# EAGLE design quick_mock (EAGLE 9.6.2)
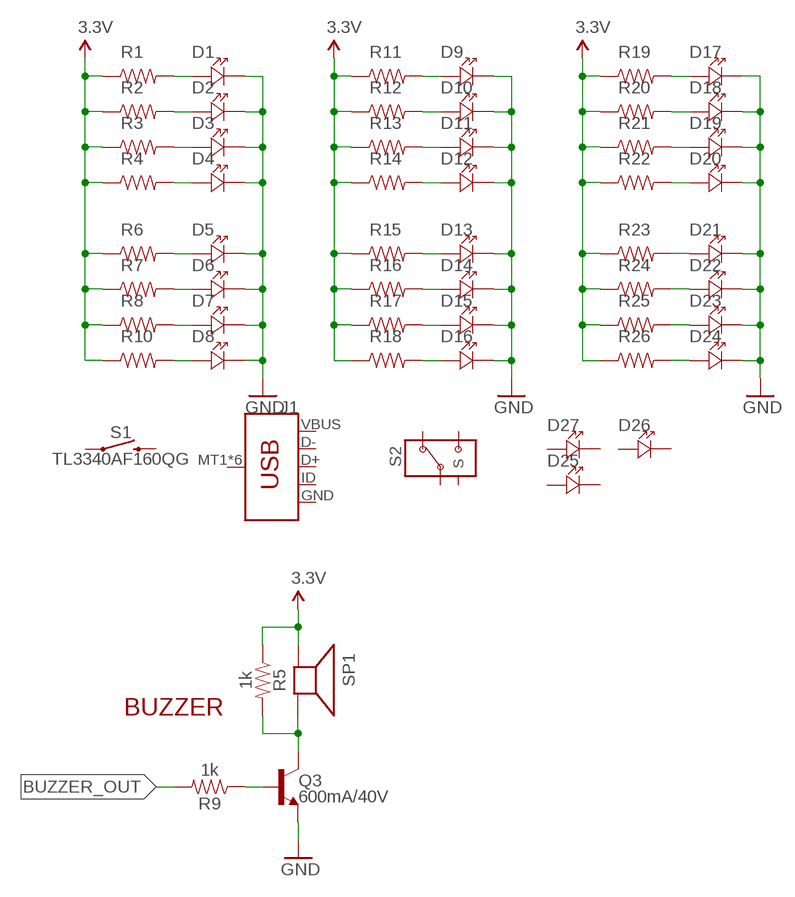
[diagram p0: schematic, sheet 1]

## Parts
D1  LED-603  [SMD-603]
D2  LED-603  [SMD-603]
D3  LED-603  [SMD-603]
D4  LED-603  [SMD-603]
D5  LED-603  [SMD-603]
D6  LED-603  [SMD-603]
D7  LED-603  [SMD-603]
D8  LED-603  [SMD-603]
D9  LED-603  [SMD-603]
D10  LED-603  [SMD-603]
D11  LED-603  [SMD-603]
D12  LED-603  [SMD-603]
D13  LED-603  [SMD-603]
D14  LED-603  [SMD-603]
D15  LED-603  [SMD-603]
D16  LED-603  [SMD-603]
D17  LED-603  [SMD-603]
D18  LED-603  [SMD-603]
D19  LED-603  [SMD-603]
D20  LED-603  [SMD-603]
D21  LED-603  [SMD-603]
D22  LED-603  [SMD-603]
D23  LED-603  [SMD-603]
D24  LED-603  [SMD-603]
D25  VSMB2020X01  [GULL-WING-2.3MM]
D26  LED-603  [SMD-603]
D27  VSMB2020X01  [GULL-WING-2.3MM]
J1  USB_MICRO-B  [USB-MICROB-10118192]
Q3  600mA/40V  TRANS_NPN-MMBT2222AL  [SOT23-3]
R1  RESISTOR-603  [SMD-603]
R2  RESISTOR-603  [SMD-603]
R3  RESISTOR-603  [SMD-603]
R4  RESISTOR-603  [SMD-603]
R5  1k  10KOHM-0603-1/10W-1%  [0603]
R6  RESISTOR-603  [SMD-603]
R7  RESISTOR-603  [SMD-603]
R8  RESISTOR-603  [SMD-603]
R9  1k  10KOHM-0603-1/10W-1%  [0603]
R10  RESISTOR-603  [SMD-603]
R11  RESISTOR-603  [SMD-603]
R12  RESISTOR-603  [SMD-603]
R13  RESISTOR-603  [SMD-603]
R14  RESISTOR-603  [SMD-603]
R15  RESISTOR-603  [SMD-603]
R16  RESISTOR-603  [SMD-603]
R17  RESISTOR-603  [SMD-603]
R18  RESISTOR-603  [SMD-603]
R19  RESISTOR-603  [SMD-603]
R20  RESISTOR-603  [SMD-603]
R21  RESISTOR-603  [SMD-603]
R22  RESISTOR-603  [SMD-603]
R23  RESISTOR-603  [SMD-603]
R24  RESISTOR-603  [SMD-603]
R25  RESISTOR-603  [SMD-603]
R26  RESISTOR-603  [SMD-603]
S1  TL3340AF160QG  [3PIN_GULLWING_4.0X3.3MM]
S2  CUS-12B  [CUS-12_SPDT]
SP1  SPEAKER/PS12  [PS12]

## Nets
3.3V: R1.1 R2.1 R3.1 R4.1 R5.1 R6.1 R7.1 R8.1 R10.1 R11.1 R12.1 R13.1 R14.1 R15.1 R16.1 R17.1 R18.1 R19.1 R20.1 R21.1 R22.1 R23.1 R24.1 R25.1 R26.1 SP1.P$1(+)
BUZZER_OUT: R9.2
GND: D1.P$2(CATHODE-) D2.P$2(CATHODE-) D3.P$2(CATHODE-) D4.P$2(CATHODE-) D5.P$2(CATHODE-) D6.P$2(CATHODE-) D7.P$2(CATHODE-) D8.P$2(CATHODE-) D9.P$2(CATHODE-) D10.P$2(CATHODE-) D11.P$2(CATHODE-) D12.P$2(CATHODE-) D13.P$2(CATHODE-) D14.P$2(CATHODE-) D15.P$2(CATHODE-) D16.P$2(CATHODE-) D17.P$2(CATHODE-) D18.P$2(CATHODE-) D19.P$2(CATHODE-) D20.P$2(CATHODE-) D21.P$2(CATHODE-) D22.P$2(CATHODE-) D23.P$2(CATHODE-) D24.P$2(CATHODE-) Q3.2(E)
N$1: D1.P$1(ANODE+) R1.2
N$2: D2.P$1(ANODE+) R2.2
N$3: Q3.3(C) R5.2 SP1.P$2(-)
N$4: D3.P$1(ANODE+) R3.2
N$5: D4.P$1(ANODE+) R4.2
N$6: D5.P$1(ANODE+) R6.2
N$7: D6.P$1(ANODE+) R7.2
N$8: D7.P$1(ANODE+) R8.2
N$9: D8.P$1(ANODE+) R10.2
N$14: D9.P$1(ANODE+) R11.2
N$15: D10.P$1(ANODE+) R12.2
N$16: D11.P$1(ANODE+) R13.2
N$17: D12.P$1(ANODE+) R14.2
N$18: D13.P$1(ANODE+) R15.2
N$19: D14.P$1(ANODE+) R16.2
N$20: D15.P$1(ANODE+) R17.2
N$21: D16.P$1(ANODE+) R18.2
N$22: D24.P$1(ANODE+) R26.2
N$23: D23.P$1(ANODE+) R25.2
N$24: D22.P$1(ANODE+) R24.2
N$25: D21.P$1(ANODE+) R23.2
N$26: Q3.1(B) R9.1
N$27: D20.P$1(ANODE+) R22.2
N$28: D19.P$1(ANODE+) R21.2
N$29: D18.P$1(ANODE+) R20.2
N$30: D17.P$1(ANODE+) R19.2
Unconnected: D25.P$1(ANODE+) D25.P$2(CATHODE-) D26.P$1(ANODE+) D26.P$2(CATHODE-) D27.P$1(ANODE+) D27.P$2(CATHODE-) J1.D+ J1.D- J1.ID J1.MT1(SHIELD) J1.MT2(SHIELD) J1.MT3(SHIELD) J1.MT4(SHIELD) J1.P$1(SHIELD) J1.P$2(SHIELD) S1.P$1 S1.P$2 S1.P$3 S2.P$1 S2.P$2 S2.P$3 S2.P$4(S) S2.P$5(S) S2.P$6(S) S2.P$7(S)

## Notes on the sheet
- BUZZER

## Power pins joined to a net without a drawn wire
GND: J1.GND
VBUS: J1.VBUS

## Library data of the parts
D1-D24 D26 = Rob-Diodes:LED
D25 D27 = Rob-Diodes:VSMB2020X01
J1 = SparkFun-Connectors-new:USB_MICRO-B: USB Type Micro-B Connector Male/female and PTH/SMT variants SparkFun Products: SparkFun microB USB Breakout <https://www.sparkfun.com/products/12035> SparkFun USB microB Plug Breakout <https://www.sparkfun.com/products/10031> SparkFun ESP8266 Thing <https://www.sparkfun.com/products/13231>
Q3 = SparkFun-DiscreteSemi:TRANS_NPN: NPN transistor Current controlled devices typically used to amplify current or used as a switch. BC547 - COM-08928 <http://www.sparkfun.com/products/8928> (TO-92 45V 100mA) (1.Collector 2.Base 3.Emitter) 2N3904 - COM-00521 <http://www.sparkfun.com/products/521> (TO-92 40V 200mA) (1.Emitter 2.Base 3.Collector) P2N2222A - COM-12852 <http://www.sparkfun.com/products/12852> (TO-92 40V 600mA) (1.Collector 2.Base 3.Emitter); PROD_ID: TRANS-08049
R1-R4 R6-R8 R10-R26 = Rob-Resistors:RESISTOR
R5 R9 = SparkFun-Resistors:10KOHM: 10kΩ resistor A resistor is a passive two-terminal electrical component that implements electrical resistance as a circuit element. Resistors act to reduce current flow, and, at the same time, act to lower voltage levels within circuits. - Wikipedia; PROD_ID: RES-00824; VALUE: 10k
S1 = Rob-Switches:TL3340AF160QG
S2 = IDEO-Switches:CUS-12B
SP1 = adafruit:SPEAKER: SPEAKER Source: Buerklin Added PS12 (for part # PS1240 piezo) http://www.ladyada.net/library/pcb/eaglelibrary.html

## Board
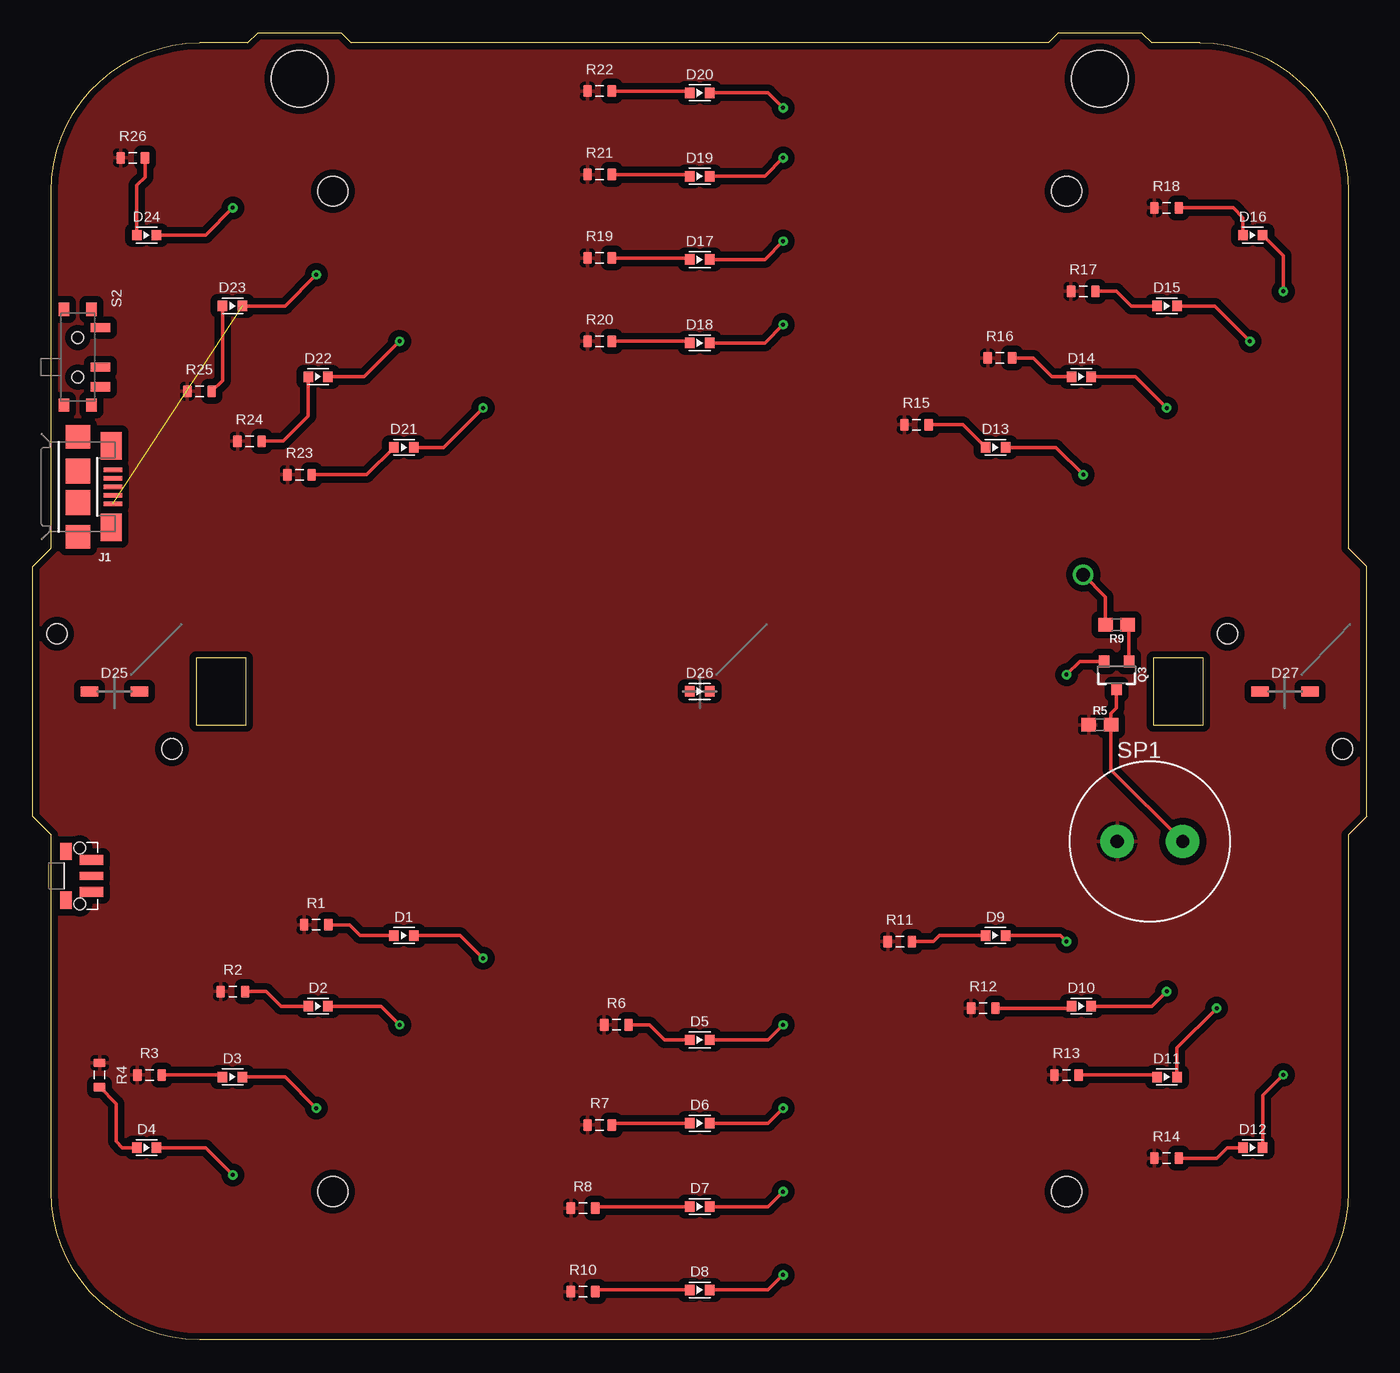
[diagram p1: board, top side]
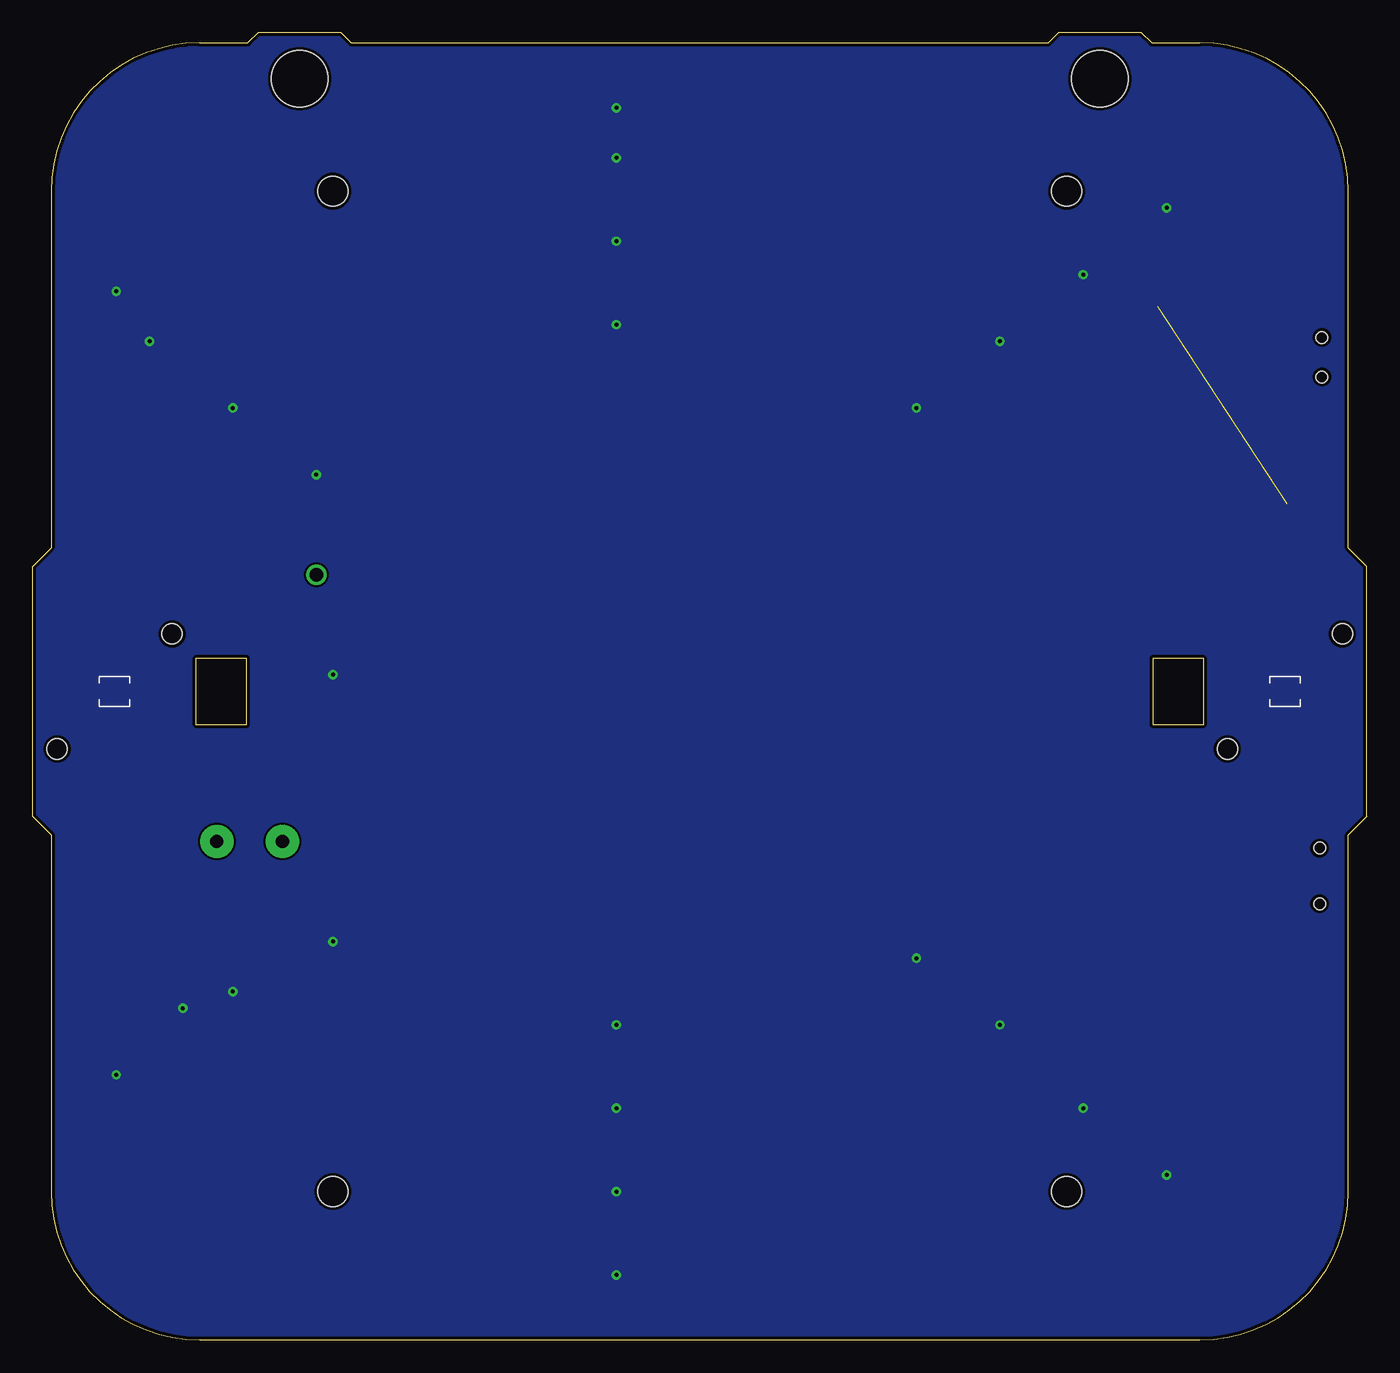
[diagram p2: board, bottom side, seen from below]

Size 101.6 x 99.57 mm. Coordinates in mm from the lower left corner, seen from the top.
Outline: 1.4,87.5 arc-90 12.7,98.81 16.38,98.81 17.14,99.57 23.5,99.57 24.26,98.81 77.34,98.81 78.11,99.57 84.45,99.57 85.22,98.81 88.9,98.81 arc-90 100.2,87.5 100.2,60.33 101.6,58.93 101.6,39.88 100.2,38.48 100.2,11.3 arc-90 88.9,0 12.7,0 arc-90 1.4,11.3 1.4,38.48 0,39.88 0,58.93 1.4,60.33 1.4,87.5
Outline: 85.34,46.86 89.15,46.86 89.15,51.94 85.34,51.94 85.34,46.86
Outline: 12.45,46.86 16.26,46.86 16.26,51.94 12.45,51.94 12.45,46.86
Copper layers (1*16): Top 0.035mm / dielectric 1.5mm / Bottom 0.035mm
Design rules "default *": minimum track width 6mil, minimum drill 10mil, track to track 6mil, track to pad 6mil, pad to pad 6mil, via to via 6mil, smd to smd 6mil, copper to edge 10mil, drill to drill 6mil, minimum pad ring 10mil, minimum via ring 8mil, stop-mask expansion 4mil, vias tented up to drill 0mil, thermal gap 10mil
Holes 1.55 mm at 10.6,45.02 91,53.78 1.84,53.78 99.76,45.02
Holes 2.29 mm at 22.86,87.5 78.74,87.5 78.74,11.3 22.86,11.3
Holes 4.32 mm at 20.32,96.08 81.28,96.08
tKeepout: area 99.1,60.8 to 100.3,63; area 99.1,35.8 to 100.3,38; area 98.2,43.5 to 101.3,46.6; area 89.4,43.5 to 92.6,46.6; area 98.2,52.2 to 101.3,55.4; area 89.4,52.2 to 92.6,55.4; area 9,43.5 to 12.2,46.6; area 0.3,43.5 to 3.4,46.6; area 9,52.2 to 12.2,55.4; area 0.3,52.2 to 3.4,55.4; area 29.7,28.3 to 50.8,70.5; area 50.8,28.3 to 71.9,70.5; 56 more areas

### Footprints (pad centres in the part's own frame; a part is rotated, then mirrored left to right if it is on the bottom)
SMD-603 = smd 0.8 x 0.8: P$1 -0.75,0; P$2 0.75,0
GULL-WING-2.3MM = smd 1.35 x 0.75: P$1 -1.9,0; P$2 1.9,0
USB-MICROB-10118192 = smd 0.35 x 1.4: D+ 0,2.65; D- -0.65,2.65; GND 1.3,2.65; ID 0.65,2.65; VBUS -1.3,2.65 | smd 1.8 x 1.9: MT1 -3.8,0; MT2 3.8,0 | smd 2.1 x 1.6: MT3 -3.1,2.54; MT4 3.1,2.54 | smd 1.9 x 1.9: P$1 -1.2,0; P$2 1.2,0
SOT23-3 = smd 0.8 x 0.9: 1 -0.95,-1; 2 0.95,-1; 3 0,1.1
SMD-603' = smd 0.65 x 0.9: 1 -0.925,0; 2 0.925,0
0603 = smd 1.1 x 1: 1 -0.85,0; 2 0.85,0
3PIN_GULLWING_4.0X3.3MM = smd 0.75 x 1.8: P$1 -1.225,2.4; P$3 1.225,2.4 | smd 0.6 x 1.8: P$2 0,2.4 | smd 1.3 x 0.9: P$4 -1.85,0.45; P$5 1.85,0.45 | hole 0.9: -2.125,1.5; 2.125,1.5
CUS-12_SPDT = smd 0.7 x 1.5: P$1 -2.25,1.75; P$2 0.75,1.75; P$3 2.25,1.75 | smd 1 x 0.8: P$4 -3.65,1.05; P$5 -3.65,-1.05; P$6 3.65,1.05; P$7 3.65,-1.05 | hole 0.9: -1.5,0; 1.5,0
PS12 = drill 1 pad 2.54: P$1 -2.5,0; P$2 2.5,0

### Placement (x,y rotation side)
D1  28.27,30.82 0 top
D2  21.74,25.43 0 top
D3  15.21,20.04 0 top
D4  8.67,14.65 0 top
D5  50.8,22.86 0 top
D6  50.8,16.51 0 top
D7  50.8,10.16 0 top
D8  50.8,3.81 0 top
D9  73.33,30.82 0 top
D10  79.87,25.43 0 top
D11  86.4,20.04 0 top
D12  92.93,14.65 0 top
D13  73.33,67.99 0 top
D14  79.87,73.38 0 top
D15  86.4,78.77 0 top
D16  92.93,84.16 0 top
D17  50.8,82.3 0 top
D18  50.8,75.95 0 top
D19  50.8,88.65 0 top
D20  50.8,95 0 top
D21  28.27,67.99 0 top
D22  21.74,73.38 0 top
D23  15.21,78.77 0 top
D24  8.67,84.16 0 top
D25  6.22,49.4 0 top
D26  50.8,49.4 0 top
D27  95.38,49.4 0 top
J1  3.44,64.99 270 top
Q3  82.55,50.67 180 top
R1  [SMD-603']  21.59,31.62 0 top
R2  [SMD-603']  15.24,26.54 0 top
R3  [SMD-603']  8.89,20.19 0 top
R4  [SMD-603']  5.08,20.19 270 top
R5  81.28,46.86 0 top
R6  [SMD-603']  44.45,24 0 top
R7  [SMD-603']  43.18,16.38 0 top
R8  [SMD-603']  41.91,10.03 0 top
R9  82.55,54.48 180 top
R10  [SMD-603']  41.91,3.68 0 top
R11  [SMD-603']  66.04,30.35 0 top
R12  [SMD-603']  72.39,25.27 0 top
R13  [SMD-603']  78.74,20.19 0 top
R14  [SMD-603']  86.36,13.84 0 top
R15  [SMD-603']  67.31,69.72 0 top
R16  [SMD-603']  73.66,74.8 0 top
R17  [SMD-603']  80.01,79.88 0 top
R18  [SMD-603']  86.36,86.23 0 top
R19  [SMD-603']  43.18,82.42 0 top
R20  [SMD-603']  43.18,76.07 0 top
R21  [SMD-603']  43.18,88.77 0 top
R22  [SMD-603']  43.18,95.12 0 top
R23  [SMD-603']  20.32,65.91 0 top
R24  [SMD-603']  16.51,68.45 0 top
R25  [SMD-603']  12.7,72.26 0 top
R26  [SMD-603']  7.62,90.04 0 top
S1  2.08,35.35 270 top
S2  3.41,74.85 270 top
SP1  85.09,37.97 0 top

### Tracks (layer width: path | path; a pad name or v marks a point on that pad's centre or on a via)
3.3V
  pour Top (isolate 0.508, rank 2): -1.27,105.28 106.68,105.28 106.68,-3.94 -1.27,-3.94
BUZZER_OUT  (via drill 1.04)
  Top 0.254: R9.2 81.7,56.6 v80.01,58.29
GND  (via drill 0.3)  (1 unrouted)
  Top 0.254: D1.P$2 32.56,30.82 v34.29,29.08 | D2.P$2 26.52,25.43 v27.94,24 | D3.P$2 19.2,20.04 v21.59,17.65 | D4.P$2 13.16,14.65 v15.24,12.57 | D8.P$2 56.01,3.81 v57.15,4.95 | D7.P$2 56.01,10.16 v57.15,11.3 | D6.P$2 56.01,16.51 v57.15,17.65 | D5.P$2 56.01,22.86 v57.15,24 | D12.P$2 93.68,18.62 v95.25,20.19 | D11.P$2 87.15,22.25 v90.17,25.27 | D10.P$2 85.24,25.43 v86.36,26.54 | D9.P$2 78.28,30.82 v78.74,30.35 | Q3.2 79.74,51.67 v78.74,50.67 | D13.P$2 77.93,67.99 v80.01,65.91 | D14.P$2 83.97,73.38 v86.36,70.99 | D15.P$2 90.02,78.77 v92.71,76.07 | D16.P$2 95.25,82.58 v95.25,79.88 | D18.P$2 55.75,75.95 v57.15,77.34 | D17.P$2 55.75,82.3 v57.15,83.69 | D19.P$2 55.75,88.65 v57.15,90.04 | D20.P$2 56.01,95 v57.15,93.85 | D24.P$2 13.16,84.16 v15.24,86.23 | D23.P$2 19.2,78.77 v21.59,81.15 | D22.P$2 25.25,73.38 v27.94,76.07 | D21.P$2 31.29,67.99 v34.29,70.99
  pour Bottom: -3.81,102.74 104.14,102.74 104.14,-7.75 -3.81,-7.75
N$1
  Top 0.254: R1.2 24.13,31.62 24.94,30.82 D1.P$1
N$2
  Top 0.254: R2.2 17.78,26.54 18.9,25.43 D2.P$1
N$3
  Top 0.254: Q3.3 82.55,48.13 82.13,47.71 R5.2 82.13,43.43 SP1.P$2
N$4
  Top 0.254: R3.2 14.3,20.19 D3.P$1
N$5
  Top 0.254: R4.2 6.35,18 6.35,15.11 6.81,14.65 D4.P$1
N$6
  Top 0.254: R6.2 46.99,24 48.13,22.86 D5.P$1
N$7
  Top 0.254: R7.2 44.23,16.51 D6.P$1
N$8
  Top 0.254: R8.2 42.96,10.16 D7.P$1
N$9
  Top 0.254: R10.2 42.96,3.81 D8.P$1
N$14
  Top 0.254: R11.2 68.58,30.35 69.04,30.82 D9.P$1
N$15
  Top 0.254: R12.2 78.96,25.27 D10.P$1
N$16
  Top 0.254: R13.2 85.49,20.19 D11.P$1
N$17
  Top 0.254: R14.2 90.17,13.84 90.98,14.65 D12.P$1
N$18
  Top 0.254: D13.P$1 70.85,69.72 R15.2
N$19
  Top 0.254: R16.2 76.2,74.8 77.62,73.38 D14.P$1
N$20
  Top 0.254: R17.2 82.55,79.88 83.67,78.77 D15.P$1
N$21
  Top 0.254: R18.2 91.44,86.23 92.18,85.5 D16.P$1
N$22
  Top 0.254: R26.2 8.54,88.59 7.92,87.96 D24.P$1
N$23
  Top 0.254: R25.2 14.46,73.09 D23.P$1
N$24
  Top 0.254: R24.2 19.05,68.45 20.99,70.39 D22.P$1
N$25
  Top 0.254: R23.2 25.44,65.91 D21.P$1
N$26
  Top 0.254: R9.1 83.5,54.38 Q3.1
N$27
  Top 0.254: R22.2 49.92,95.12 D20.P$1
N$28
  Top 0.254: R21.2 49.92,88.77 D19.P$1
N$29
  Top 0.254: R20.2 49.92,76.07 D18.P$1
N$30
  Top 0.254: R19.2 49.92,82.42 D17.P$1

### Text on the board
Reference: 39.52
tDocu: Transmitter | Receiver | Transmitter